# Altium schematic sheet schmitt_trigger.SchDoc
size A; SheetNumber: 3; SheetTotal: 8
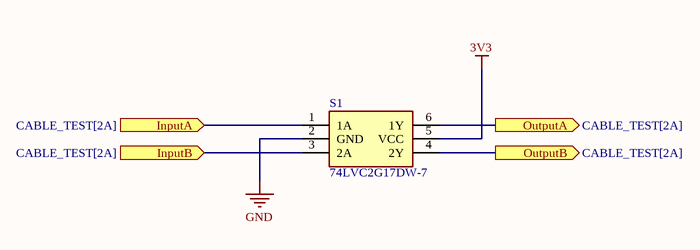
[diagram p0: schmitt_trigger.SchDoc]

## Parts
S1  74LVC2G17DW-7  [SOT65P210X110-6N]

## Ports
InputA (in, see CABLE_TEST[2A]), InputB (in, see CABLE_TEST[2A]), OutputA (out, see CABLE_TEST[2A]), OutputB (out, see CABLE_TEST[2A])

## Nets
3V3: S1.5(VCC)
GND: S1.2(GND)
InputA: S1.1(1A) ; port InputA
InputB: S1.3(2A) ; port InputB
OutputA: S1.6(1Y) ; port OutputA
OutputB: S1.4(2Y) ; port OutputB

## Library data of the parts
S1 = 74LVC2G17DW-7: Integrated Circuit; Manufacturer_Name: Diodes Incorporated; Datasheet Link: https://www.diodes.com//assets/Datasheets/74LVC2G17.pdf; Height: 1.1mm; Manufacturer_Part_Number: 74LVC2G17DW-7; Mouser Part Number: 621-74LVC2G17DW-7; Mouser Price/Stock: https://www.mouser.co.uk/ProductDetail/Diodes-Incorporated/74LVC2G17DW-7?qs=MKoP7Oyr0W5RvcSrLnJhQA%3D%3D; Arrow Part Number: 74LVC2G17DW-7; Arrow Price/Stock: https://www.arrow.com/en/products/74lvc2g17dw-7/diodes-incorporated?utm_currency=USD&region=nac